# EasyEDA schematic SCH.json

## Sheets
1 Sensors: TITLE: Sensors; REV: 1.0; Date: 2024-06-27; Sheet: 1/3; Drawn By: David; Company: RocketFlight
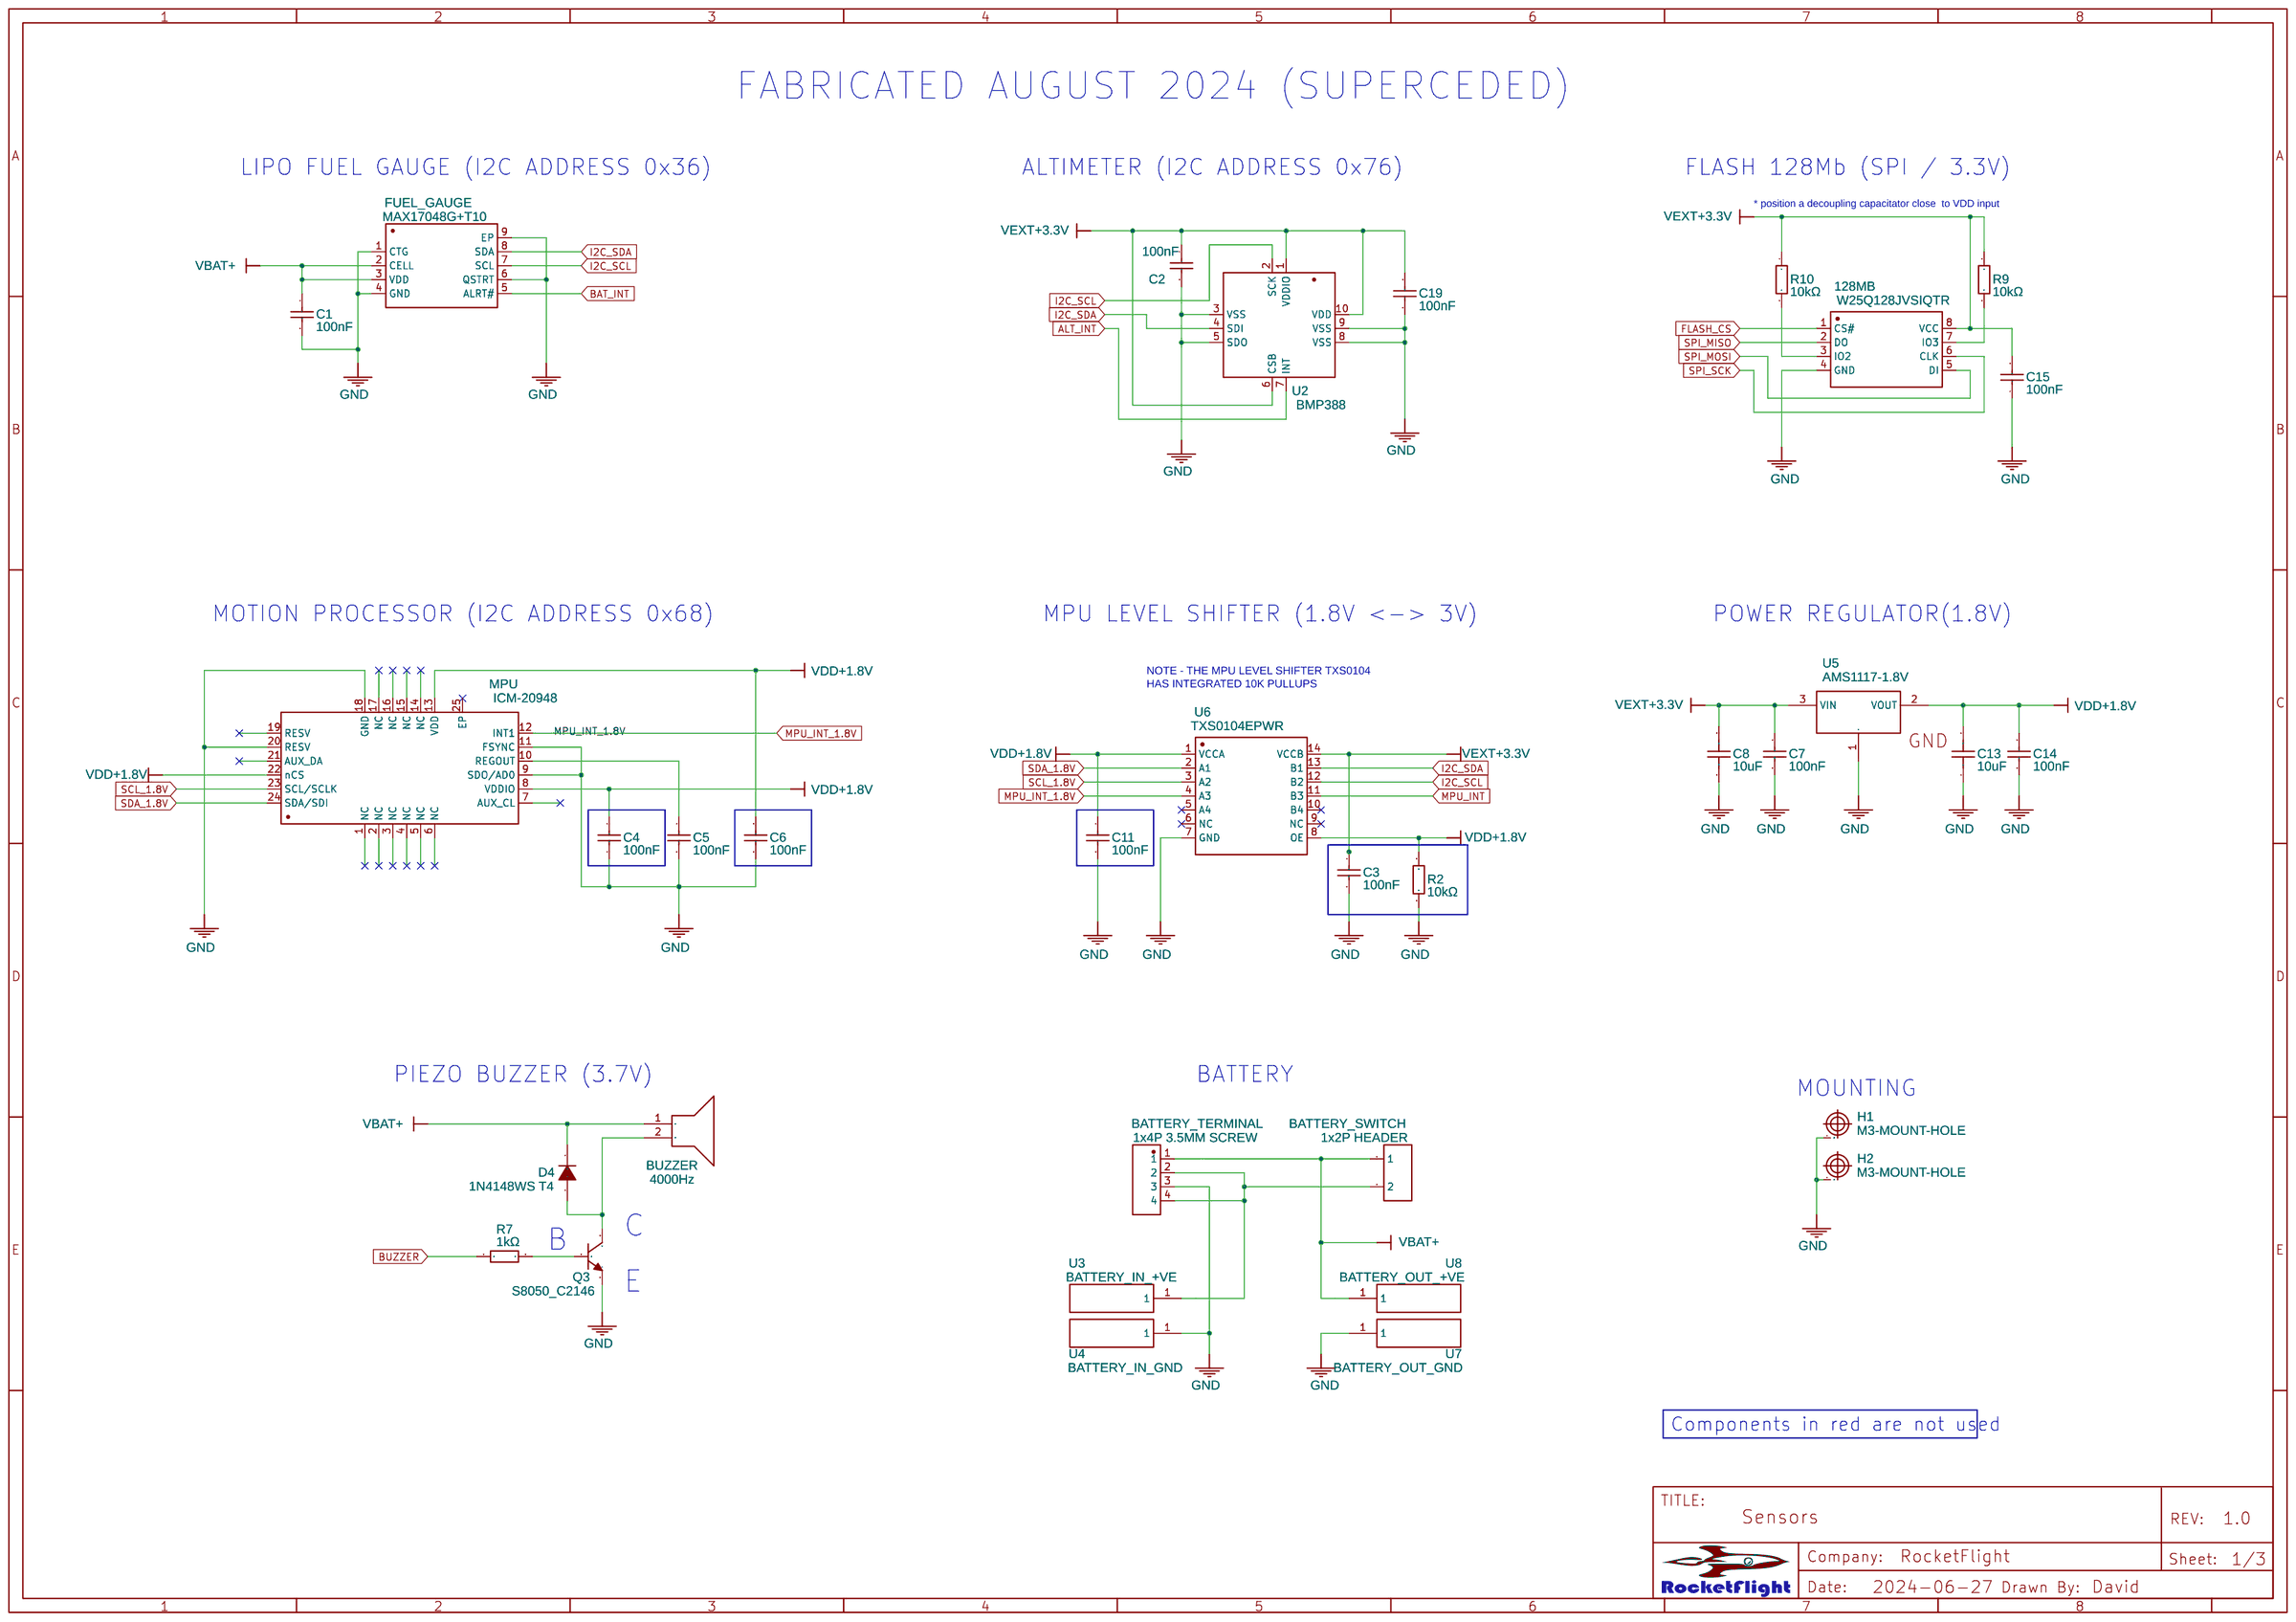
[diagram p0: Sensors]
2 Board: TITLE: Board Footprint; Date: 2024-07-18; Sheet: 2/2
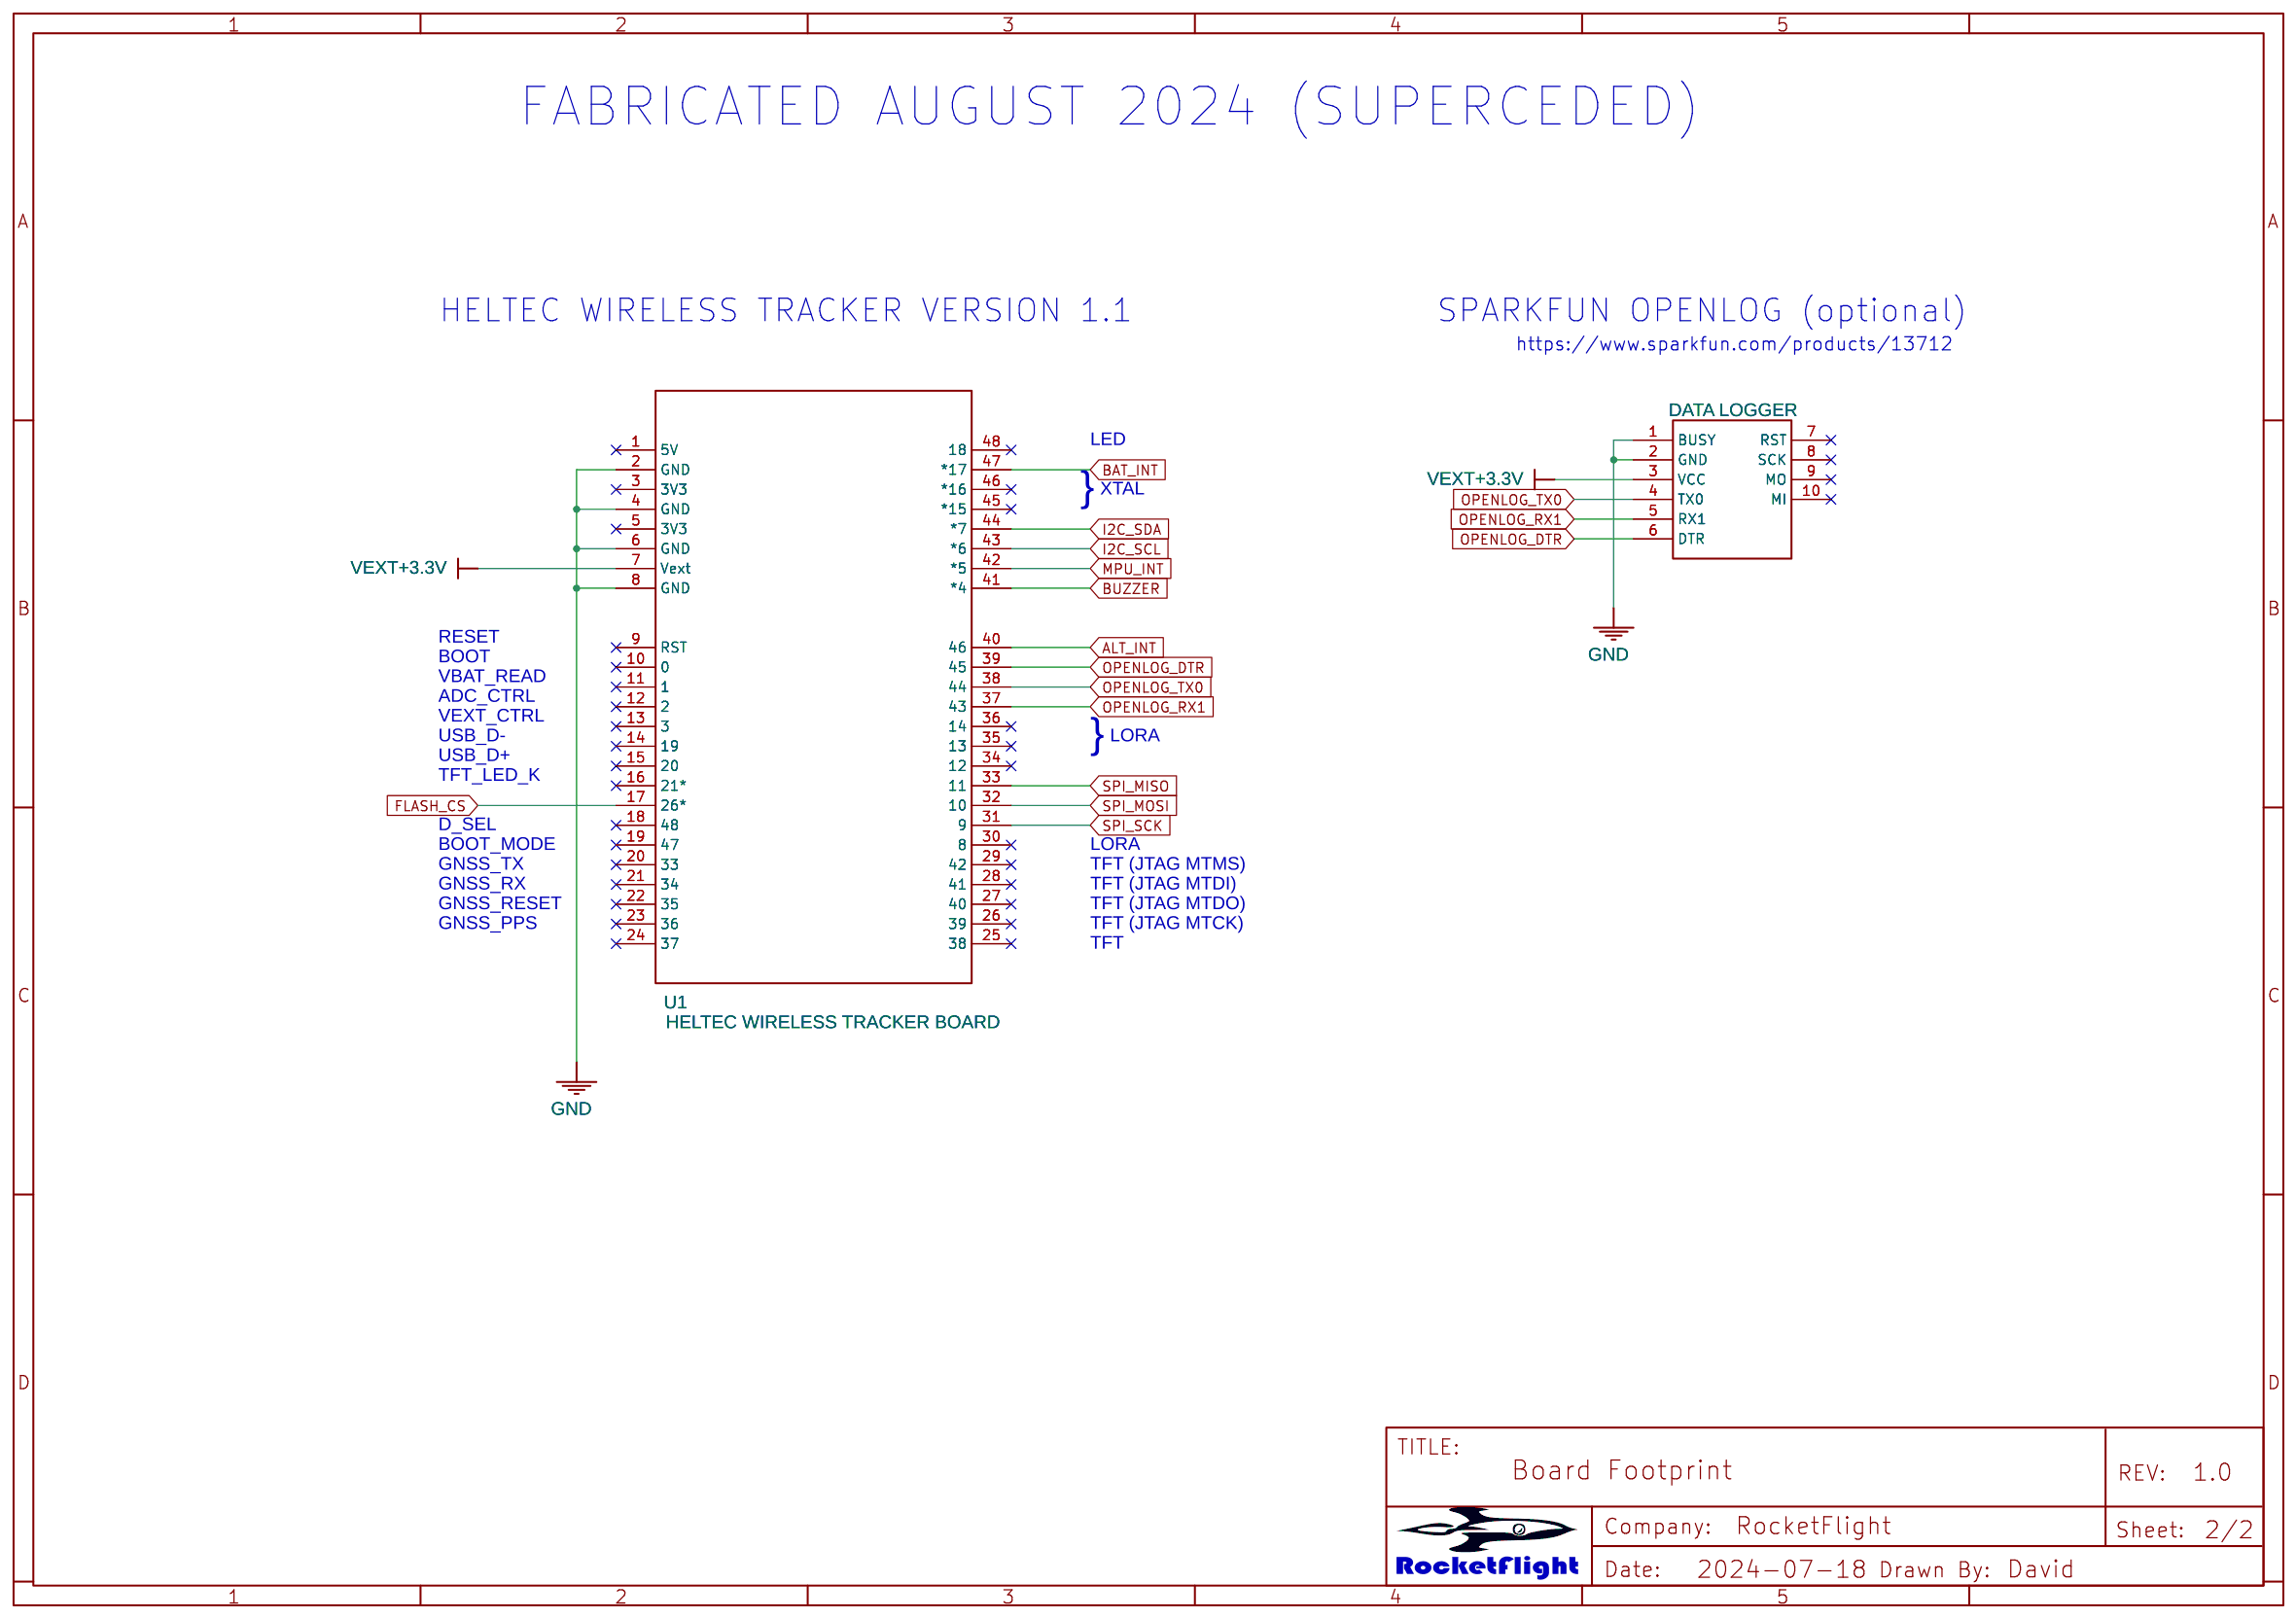
[diagram p1: Board]

## Parts
sheet Board
BUSY  DATA LOGGER
U1  HELTEC WIRELESS TRACKER BOARD  [HELTEC WIRELESS TRACKER BOARD]
sheet Sensors
128MB  W25Q128JVSIQTR  [SOIC-8_L5.3-W5.3-P1.27-LS8.0-BL]
BATTERY_SWITCH  1x2P HEADER  [HDR-M-2.54_1X2_ROUND]
BATTERY_TERMINAL  1x4P 3.5MM SCREW  [CONN-TH_XY350V-3.5-4P]
BUZZER  4000Hz  [BUZ-SMD_FST-9018]
C1  100nF  [C0402]
C2  100nF  [C0402]
C3  100nF  [C0402]
C4  100nF  [C0402]
C5  100nF  [C0402]
C6  100nF  [C0402]
C7  100nF  [C0402]
C8  10uF  [C0603]
C11  100nF  [C0402]
C13  10uF  [C0603]
C14  100nF  [C0402]
C15  100nF  [C0402]
C19  100nF  [C0402]
D4  1N4148WS T4  [SOD-323_L1.8-W1.3-LS2.5-RD]
FUEL_GAUGE  MAX17048G+T10  [DFN-8_L2.0-W2.0-P0.50-BL-EP]
H1  M3-MOUNT-HOLE  [M3-MOUNT-HOLE]
H2  M3-MOUNT-HOLE  [M3-MOUNT-HOLE]
MPU  ICM-20948  [QFN-24_L3.0-W3.0-P0.40-BL-EP]
Q3  S8050_C2146  [SOT-23-3_L3.0-W1.7-P0.95-LS2.9-BR]
R2  10kΩ  [R0402]
R7  1kΩ  [R0603]
R9  10kΩ  [R0402]
R10  10kΩ  [R0402]
U2  BMP388  [SENSORM-SMD_BMP388]
U3  BATTERY_IN_+VE  [MYSOLDERPAD1.5X2.5]
U4  BATTERY_IN_GND  [MYSOLDERPAD1.5X2.5]
U5  AMS1117-1.8V  [SOT-89-3_L4.5-W2.5-P1.50-LS4.1-BR]
U6  TXS0104EPWR  [TSSOP-14_L5.0-W4.4-P0.65-LS6.4-BL]
U7  BATTERY_OUT_GND  [MYSOLDERPAD1.5X2.5]
U8  BATTERY_OUT_+VE  [MYSOLDERPAD1.5X2.5]

## Library data of the parts
BUSY = DATA LOGGER_RN_OPENLOG COPY: Manufacturer Part: Sparkfun; Manufacturer: Sparkfun; Supplier Part: https://www.sparkfun.com/products/13712; Supplier: Sparkfun
U1 = HELTEC WIRELESS TRACKER BOARD: Contributor: Oleg Reviztsev
128MB = W25Q128JVSIQTR: Supplier: LCSC; Manufacturer: WINBOND(华邦); Manufacturer Part: W25Q128JVSIQ; Supplier Part: C97521; JLCPCB Part Class: Basic Part
BATTERY_SWITCH = HDR-M-2.54_1X2_ROUND: Supplier: LCSC; Manufacturer: TE Connectivity; Manufacturer Part: 826629-2; image: //image.lceda.cn/szlcsc/C86471.jpg; Supplier Part: C86471; Contributor: plainolddave
BATTERY_TERMINAL = XY350V-3.5-4P: Supplier: LCSC; Supplier Part: C557656; Manufacturer: --; Contributor: LCSC; LCSC Assembly: Yes; SMT Type: Extend; Assembly Type: manualWeld; Paste Type: expand
BUZZER = FST-9018 COPY: Contributor: LCSC; Supplier: LCSC; Supplier Part: C391035; Manufacturer: FUET(福声科技); Manufacturer Part: FUET-9018; JLCPCB Part Class: Extended Part
C1-C7 C11 C14 C15 C19 = CL05B104KO5NNNC: Supplier: LCSC; Manufacturer: SAMSUNG(三星); Supplier Part: C1525; JLCPCB Part Class: Basic Part
C8 C13 = CL10A106MA8NRNC: Supplier: LCSC; Manufacturer: SAMSUNG(三星); Supplier Part: C96446; JLCPCB Part Class: Basic Part
D4 = 1N4148WS T4: Supplier: LCSC; Manufacturer: CJ(江苏长电/长晶); Manufacturer Part: 1N4148WS; Supplier Part: C2128; JLCPCB Part Class: Basic Part
FUEL_GAUGE = MAX17048G+T10: Contributor: LCSC; Supplier: LCSC; Supplier Part: C2682616; Manufacturer: ADI(亚德诺)/MAXIM(美信); JLCPCB Part Class: Extended Part
H1 H2 = M3-MOUNT-HOLE: Contributor: adamalfath
MPU = ICM-20948: Contributor: lcsc; Supplier: LCSC; Supplier Part: C726001; Manufacturer: TDK InvenSense(应美盛); JLCPCB Part Class: Extended Part
Q3 = S8050_C2146: Supplier: LCSC; Manufacturer: CJ(江苏长电/长晶); Manufacturer Part: S8050 J3Y; Supplier Part: C2146; JLCPCB Part Class: Basic Part
R2 R9 R10 = 0402WGF1002TCE: Supplier: LCSC; Manufacturer: UNI-ROYAL(厚声); Supplier Part: C25744; JLCPCB Part Class: Basic Part
R7 = 0603WAF1001T5E: Supplier: LCSC; Manufacturer: UNI-ROYAL(厚声); Supplier Part: C21190; JLCPCB Part Class: Basic Part
U2 = BMP388: Contributor: LCSC; Supplier: LCSC; Supplier Part: C779278; Manufacturer: Bosch(博世); JLCPCB Part Class: Extended Part
U3 U4 U7 U8 = MySolderPad1.5x2.5mm: Supplier Part: C9900000335; Manufacturer Part: PAD_5.84mm×1.54mm×0.8mm; JLCPCB Part Class: Extended Part; Contributor: Filip Straka
U5 = AMS1117-1.8V: Supplier: LCSC; Supplier Part: C5120766; Manufacturer: MSKSEMI(美森科); JLCPCB Part Class: Extended Part; Contributor: lcsc
U6 = TXS0104EPWR: Supplier: LCSC; Manufacturer: TI(德州仪器); Supplier Part: C44955; JLCPCB Part Class: Extended Part

## Nets
GND: 128MB.4(GND) BATTERY_TERMINAL.3 BUSY.1(BUSY) BUSY.2(GND) C1.2 C2.2 C3.2 C4.1 C5.2 C6.1 C7.1 C8.1 C11.2 C13.1 C14.1 C15.1 C19.2 FUEL_GAUGE.1(CTG) FUEL_GAUGE.4(GND) FUEL_GAUGE.6(QSTRT) FUEL_GAUGE.9(EP) H1.1(GND) H2.1(GND) MPU.9(SDO/AD0) MPU.11(FSYNC) MPU.18(GND) MPU.20(RESV) Q3.2(E) R2.1 U1.2(GND) U1.4(GND) U1.6(GND) U1.8(GND) U2.3(VSS) U2.5(SDO) U2.8(VSS) U2.9(VSS) U4.1 U5.1(GND) U6.7(GND) U7.1
VBAT+: BATTERY_SWITCH.1 BATTERY_TERMINAL.1 BUZZER.1 C1.1 D4.1(K) FUEL_GAUGE.2(CELL) FUEL_GAUGE.3(VDD) U8.1
VDD+1.8V: C4.2 C6.2 C11.1 C13.2 C14.2 MPU.8(VDDIO) MPU.13(VDD) MPU.22(nCS) R2.2 U5.2(VOUT) U6.1(VCCA) U6.8(OE)
ALT_INT: U1.40(46) U2.7(INT)
BAT_INT: FUEL_GAUGE.5(ALRT#) U1.47(*17)
BUZZER: R7.1 U1.41(*4)
FLASH_CS: 128MB.1(CS#) U1.17(26*)
I2C_SCL: FUEL_GAUGE.7(SCL) U1.43(*6) U2.2(SCK) U6.12(B2)
I2C_SDA: FUEL_GAUGE.8(SDA) U1.44(*7) U2.4(SDI) U6.13(B1)
MPU_INT: U1.42(*5) U6.11(B3)
MPU_INT_1.8V: MPU.12(INT1) U6.4(A3)
OPENLOG_DTR: BUSY.6(DTR) U1.39(45)
OPENLOG_RX1: BUSY.5(RX1) U1.37(43)
OPENLOG_TX0: BUSY.4(TX0) U1.38(44)
SCL_1.8V: MPU.23(SCL/SCLK) U6.3(A2)
SDA_1.8V: MPU.24(SDA/SDI) U6.2(A1)
SPI_MISO: 128MB.2(DO) U1.33(11)
SPI_MOSI: 128MB.5(DI) U1.32(10)
SPI_SCK: 128MB.6(CLK) U1.31(9)
VEXT+3.3V: 128MB.8(VCC) BUSY.3(VCC) C2.1 C3.1 C7.2 C8.2 C15.2 C19.1 R9.1 R10.1 U1.7(Vext) U2.1(VDDIO) U2.6(CSB) U2.10(VDD) U5.3(VIN) U6.14(VCCB)
Net-(128MB-3): 128MB.3(IO2) R10.2
Net-(128MB-7): 128MB.7(IO3) R9.2
Net-(BATTERY_SWITCH-2): BATTERY_SWITCH.2 BATTERY_TERMINAL.2 BATTERY_TERMINAL.4 U3.1
Net-(BUZZER-2): BUZZER.2 D4.2(A) Q3.3(C)
Net-(C5-1): C5.1 MPU.10(REGOUT)
Net-(Q3-1): Q3.1(B) R7.2

Not connected (* = marked no-connect by the designer): BUSY 7(RST)* 8(SCK)* 9(MO)* 10(MI)*; MPU 1(NC) 2(NC) 3(NC) 4(NC) 5(NC) 6(NC) 7(AUX_CL) 14(NC) 15(NC) 16(NC) 17(NC) 19(RESV) 21(AUX_DA) 25(EP)*; U1 1(5V)* 3(3V3)* 5(3V3)* 9(RST)* 10(0)* 11(1)* 12(2)* 13(3)* 14(19)* 15(20)* 16(21*)* 18(48)* 19(47)* 20(33)* 21(34)* 22(35)* 23(36)* 24(37)* 25(38)* 26(39)* 27(40)* 28(41)* 29(42)* 30(8)* 34(12)* 35(13)* 36(14)* 45(*15)* 46(*16)* 48(18)*; U6 5(A4)* 6(NC)* 9(NC)* 10(B4)*

## Notes on the sheets
sheet 1
- FABRICATED AUGUST 2024 (SUPERCEDED)
- LIPO FUEL GAUGE (I2C ADDRESS 0x36)
- ALTIMETER (I2C ADDRESS 0x76)
- FLASH 128Mb (SPI / 3.3V)
- * position a decoupling capacitator close  to VDD input
- MOTION PROCESSOR (I2C ADDRESS 0x68)
- MPU LEVEL SHIFTER (1.8V <-> 3V)
- POWER REGULATOR(1.8V)
- NOTE - THE MPU LEVEL SHIFTER TXS0104
  HAS INTEGRATED 10K PULLUPS
- PIEZO BUZZER (3.7V)
- BATTERY
- MOUNTING
- C
- B
- E
- Components in red are not used
sheet 2
- FABRICATED AUGUST 2024 (SUPERCEDED)
- HELTEC WIRELESS TRACKER VERSION 1.1
- SPARKFUN OPENLOG (optional)
- https://www.sparkfun.com/products/13712
- LED
- }
- XTAL
- BOOT
- RESET
- VBAT_READ
- ADC_CTRL
- VEXT_CTRL
- }
- USB_D-
- LORA
- TFT_LED_K
- USB_D+
- BOOT_MODE
- D_SEL
- LORA
- GNSS_TX
- TFT (JTAG MTMS)
- GNSS_RX
- TFT (JTAG MTDI)
- GNSS_RESET
- TFT (JTAG MTDO)
- GNSS_PPS
- TFT (JTAG MTCK)
- TFT
